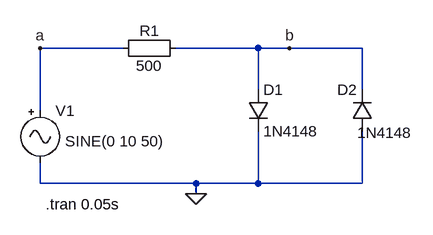
[diagram p0: schematic limiter_diod_two_sided.asc]
limiter_diod_two_sided.asc, the LTspice schematic file:
Version 4
SHEET 1 880 680
WIRE -64 128 -192 128
WIRE 144 128 16 128
WIRE 192 128 144 128
WIRE 304 128 192 128
WIRE 144 192 144 128
WIRE 304 192 304 128
WIRE -192 224 -192 128
WIRE -192 336 -192 304
WIRE 48 336 -192 336
WIRE 144 336 144 256
WIRE 144 336 48 336
WIRE 304 336 304 256
WIRE 304 336 144 336
WIRE 48 352 48 336
FLAG -192 128 a
FLAG 192 128 b
FLAG 48 352 0
SYMBOL diode 128 192 R0
SYMATTR InstName D1
SYMATTR Value 1N4148
SYMBOL Misc\\signal -192 208 R0
WINDOW 123 0 0 Left 2
WINDOW 39 0 0 Left 2
WINDOW 3 38 63 Left 2
SYMATTR Value SINE(0 10 50)
SYMATTR InstName V1
SYMBOL Misc\\EuropeanResistor 32 112 R90
WINDOW 0 5 56 VBottom 2
WINDOW 3 27 56 VTop 2
SYMATTR InstName R1
SYMATTR Value 500
SYMBOL diode 320 256 R180
WINDOW 0 24 64 Left 2
WINDOW 3 -61 -2 Left 2
SYMATTR InstName D2
SYMATTR Value 1N4148
TEXT -184 368 Left 2 !.tran 0.05s

The netlist it stands for:
* limiter_diod_two_sided.asc
D1 b 0 1N4148
V1 a 0 SINE(0 10 50)
R1 b a 500
D2 0 b 1N4148
.model D D
.lib standard.dio
.tran 0.05s
.backanno
.end